# EAGLE design alpha_board (EAGLE 6.5.0)
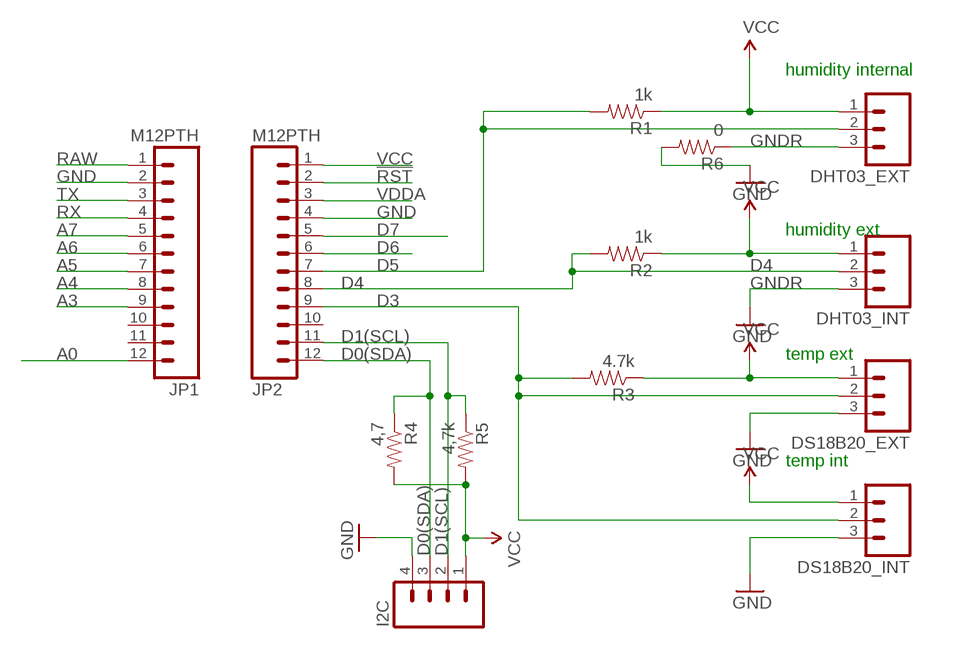
[diagram p0: schematic, sheet 1]

## Parts
DHT03_EXT  M03LOCK  [1X03_LOCK]
DHT03_INT  M03LOCK  [1X03_LOCK]
DS18B20_EXT  M03LOCK  [1X03_LOCK]
DS18B20_INT  M03LOCK  [1X03_LOCK]
I2C  M04LOCK_LONGPADS  [1X04_LOCK_LONGPADS]
JP1  M12PTH  [1X12-SMALL-PADS]
JP2  M12PTH  [1X12-SMALL-PADS]
R1  1k  RESISTOR1206  [1206]
R2  1k  RESISTOR1206  [1206]
R3  4.7k  RESISTOR1206  [1206]
R4  4,7  RESISTOR1206  [1206]
R5  4,7k  RESISTOR1206  [1206]
R6  0  RESISTOR1206  [1206]

## Nets
!RST: JP2.2
A0: JP1.12
A3: JP1.9
A4: JP1.8
A5: JP1.7
A6: JP1.6
A7: JP1.5
D0(SDA): I2C.3 JP2.12 R4.1
D1(SCL): I2C.2 JP2.11 R5.1
D3: DS18B20_EXT.2 DS18B20_INT.2 JP2.9 R3.2
D4: DHT03_INT.2 JP2.8 R2.2
D5: DHT03_EXT.2 JP2.7 R1.2
D6: JP2.6
D7: JP2.5
GND: DS18B20_EXT.3 DS18B20_INT.3 I2C.4 JP1.2 JP2.4 R6.2
GNDR: DHT03_EXT.3 DHT03_INT.3 R6.1 ; supply symbol labelled GND
RAW [vcc]: JP1.1
RX: JP1.4
TX: JP1.3
VCC: DHT03_EXT.1 DHT03_INT.1 DS18B20_EXT.1 DS18B20_INT.1 I2C.1 JP2.1 R1.1 R2.1 R3.1 R4.2 R5.2
VDDA: JP2.3
Unconnected: JP1.10 JP1.11 JP2.10

## Notes on the sheet
- humidity internal
- humidity ext
- temp ext
- temp int

## Library data of the parts
DHT03_EXT DHT03_INT DS18B20_EXT DS18B20_INT = SparkFun:M03: Header 3 Standard 3-pin 0.1" header. Use with straight break away headers (SKU : PRT-00116), right angle break away headers (PRT-00553), swiss pins (PRT-00743), machine pins (PRT-00117), and female headers (PRT-00115). Molex polarized connector foot print use with SKU : PRT-08232 with associated crimp pins and housings.
I2C = SparkFun-Connectors:M04: Header 4 Standard 4-pin 0.1" header. Use with straight break away headers (SKU : PRT-00116), right angle break away headers (PRT-00553), swiss pins (PRT-00743), machine pins (PRT-00117), and female headers (PRT-00115). Molex polarized connector foot print use with SKU : PRT-08231 with associated crimp pins and housings. 1MM SMD Version SKU: PRT-10208
JP1 JP2 = Spark:M12: Header 12 Standard 12-pin 0.1" header. Use with straight break away headers (SKU : PRT-00116), right angle break away headers (PRT-00553), swiss pins (PRT-00743), machine pins (PRT-00117), and female headers (PRT-00115).
R1-R6 = SparkFun:RESISTOR: Resistor Basic schematic elements and footprints for 0603, 1206, and PTH resistors.

## Board
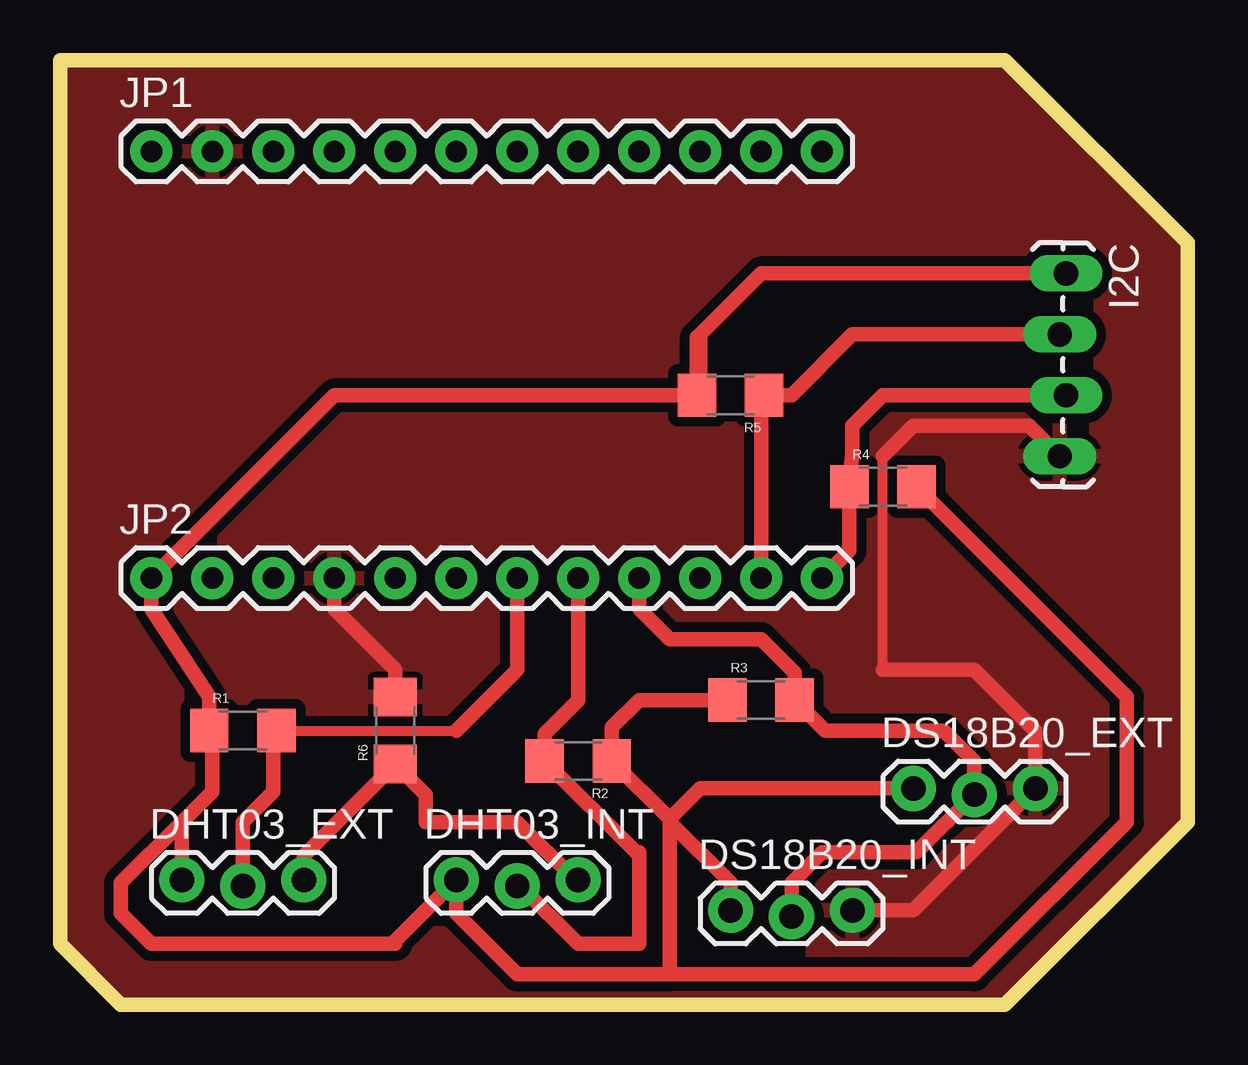
[diagram p1: board, top side]
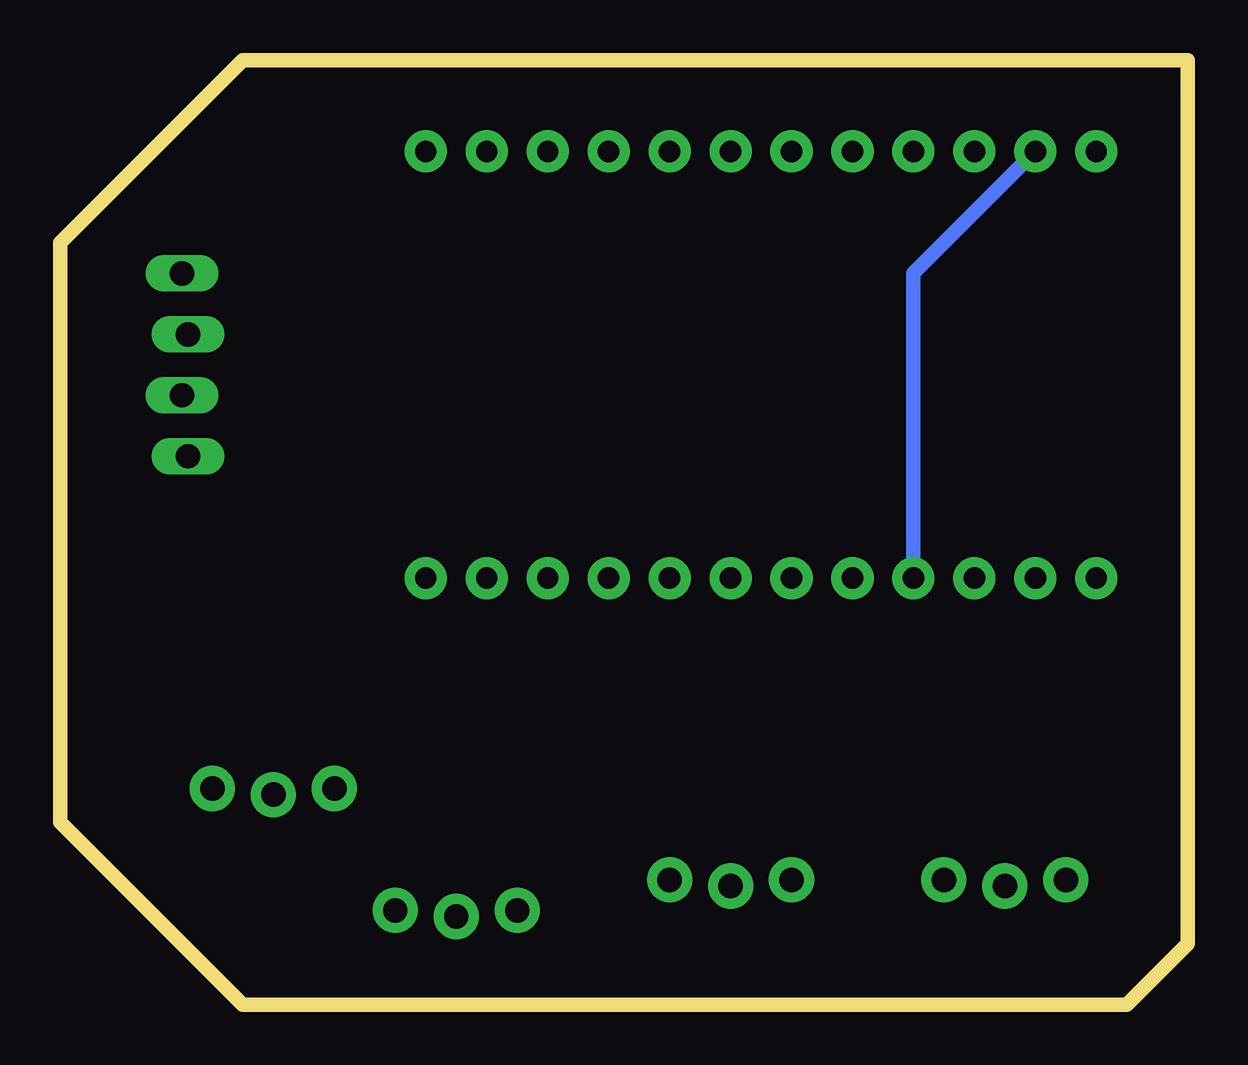
[diagram p2: board, bottom side, seen from below]

Size 46.99 x 39.37 mm. Coordinates in mm from the lower left corner, seen from the top.
Outline: 0,39.37 0,2.54 2.54,0 39.37,0 46.99,7.62 46.99,31.75 39.37,39.37 0,39.37
Copper layers (1*16): Top 0.035mm / dielectric 1.5mm / Bottom 0.035mm
Design rules "default *": minimum track width 10mil, minimum drill 24mil, track to track 8mil, track to pad 8mil, pad to pad 8mil, via to via 8mil, smd to smd 8mil, copper to edge 0mil, drill to drill 8mil, minimum pad ring 10mil, minimum via ring 8mil, stop-mask expansion 4mil, vias tented up to drill 0mil, thermal gap 10mil

### Footprints (pad centres in the part's own frame; a part is rotated, then mirrored left to right if it is on the bottom)
1X03_LOCK = drill 1.016 pad 1.88: 1 0,0.127; 2 2.54,-0.127; 3 5.08,0.127
1X04_LOCK_LONGPADS = drill 1.016 long: 1 0,0; 2 2.54,-0.254; 3 5.08,0; 4 7.62,-0.254
1X12-SMALL-PADS = drill 0.889 pad 1.753: 1 0,0; 2 2.54,0; 3 5.08,0; 4 7.62,0; 5 10.16,0; 6 12.7,0; 7 15.24,0; 8 17.78,0; 9 20.32,0; 10 22.86,0; 11 25.4,0; 12 27.94,0
1206 = smd 1.6 x 1.8: 1 -1.4,0; 2 1.4,0

### Placement (x,y rotation side)
DHT03_EXT  5.08,5.08 0 top
DHT03_INT  16.51,5.08 0 top
DS18B20_EXT  35.56,8.89 0 top
DS18B20_INT  27.94,3.81 0 top
I2C  41.91,30.48 270 top
JP1  3.81,35.56 0 top
JP2  3.81,17.78 0 top
R1  7.62,11.43 0 top
R2  21.59,10.16 180 top
R3  29.21,12.7 0 top
R4  34.29,21.59 0 top
R5  27.94,25.4 180 top
R6  13.97,11.43 90 top

### Tracks (layer width: path | path; a pad name or v marks a point on that pad's centre or on a via)
D0(SDA)
  Top 0.61: I2C.3 34.29,25.4 33.02,24.13 33.02,22.99 R4.1 32.89,18.92 JP2.12
D1(SCL)
  Top 0.61: JP2.11 29.21,25.27 R5.1 30.48,25.4 33.02,27.94 I2C.2
D3
  Top 0.61: R3.2 30.61,13.84 29.21,15.24 25.4,15.24 24.13,16.51 JP2.9 | 30.48,12.57 R3.2 | R3.2 31.88,11.43 36.83,11.43 38.1,10.16 DS18B20_EXT.2 35.69,6.35 31.75,6.35 30.48,5.08 DS18B20_INT.2
D4
  Top 0.61: 21.72,17.65 JP2.8 21.59,12.7 20.19,11.3 R2.2 24,6.35 24.13,6.35 24.13,2.54 21.59,2.54 19.18,4.95 DHT03_INT.2
D5
  Top 0.406: R1.2 16.51,11.43
  Top 0.61: DHT03_EXT.2 7.62,7.62 8.89,8.89 8.89,11.3 R1.2 | 16.51,11.43 19.05,13.97 JP2.7
GND
  Top 0.254: 11.94,17.53 JP2.4
  Top 0.406: 34.29,13.97 34.29,22.86
  Top 0.61: R6.2 13.97,13.97 11.43,16.51 JP2.4 | 34.29,22.86 35.56,24.13 40.39,24.13 I2C.4 | 34.29,13.97 38.1,13.97 40.64,11.43 DS18B20_EXT.3 35.56,3.94 DS18B20_INT.3
  Bottom 0.61: JP2.4 11.43,30.48 JP1.2
  pour Top (isolate 0.406): 0,39.37 0,2.54 2.54,0 39.37,0 46.99,7.62 46.99,31.75 39.37,39.37
GNDR
  Top 0.61: DHT03_EXT.3 10.16,6.22 R6.1 15.24,8.76 15.24,7.62 19.05,7.62 21.46,5.21 DHT03_INT.3
VCC
  Top 0.61: DHT03_EXT.1 5.08,7.62 | 5.08,7.62 6.35,8.89 6.35,11.3 R1.1 6.22,12.83 3.81,16.51 JP2.1 11.43,25.4 26.67,25.4 26.67,27.94 | 5.08,7.62 2.54,5.08 2.54,3.81 3.81,2.54 13.84,2.54 13.91,2.6 | 13.91,2.6 DHT03_INT.1 16.51,3.81 19.05,1.27 25.4,1.27 | 13.97,2.54 13.91,2.6 | 25.4,1.27 25.4,7.62 | 25.4,7.62 25.4,7.75 | 25.4,7.75 R2.1 22.99,11.56 24.13,12.7 R3.1 | DS18B20_EXT.1 26.67,9.02 25.4,7.75 | 25.4,1.27 38.1,1.27 44.45,7.62 44.45,12.83 R4.2 | R5.2 26.54,27.81 26.67,27.94 | I2C.1 29.21,30.48 26.67,27.94 | DS18B20_INT.1 27.94,5.08 25.4,7.62